# EAGLE schematic SRA_20_V8.7 (EAGLE 9.5.2)
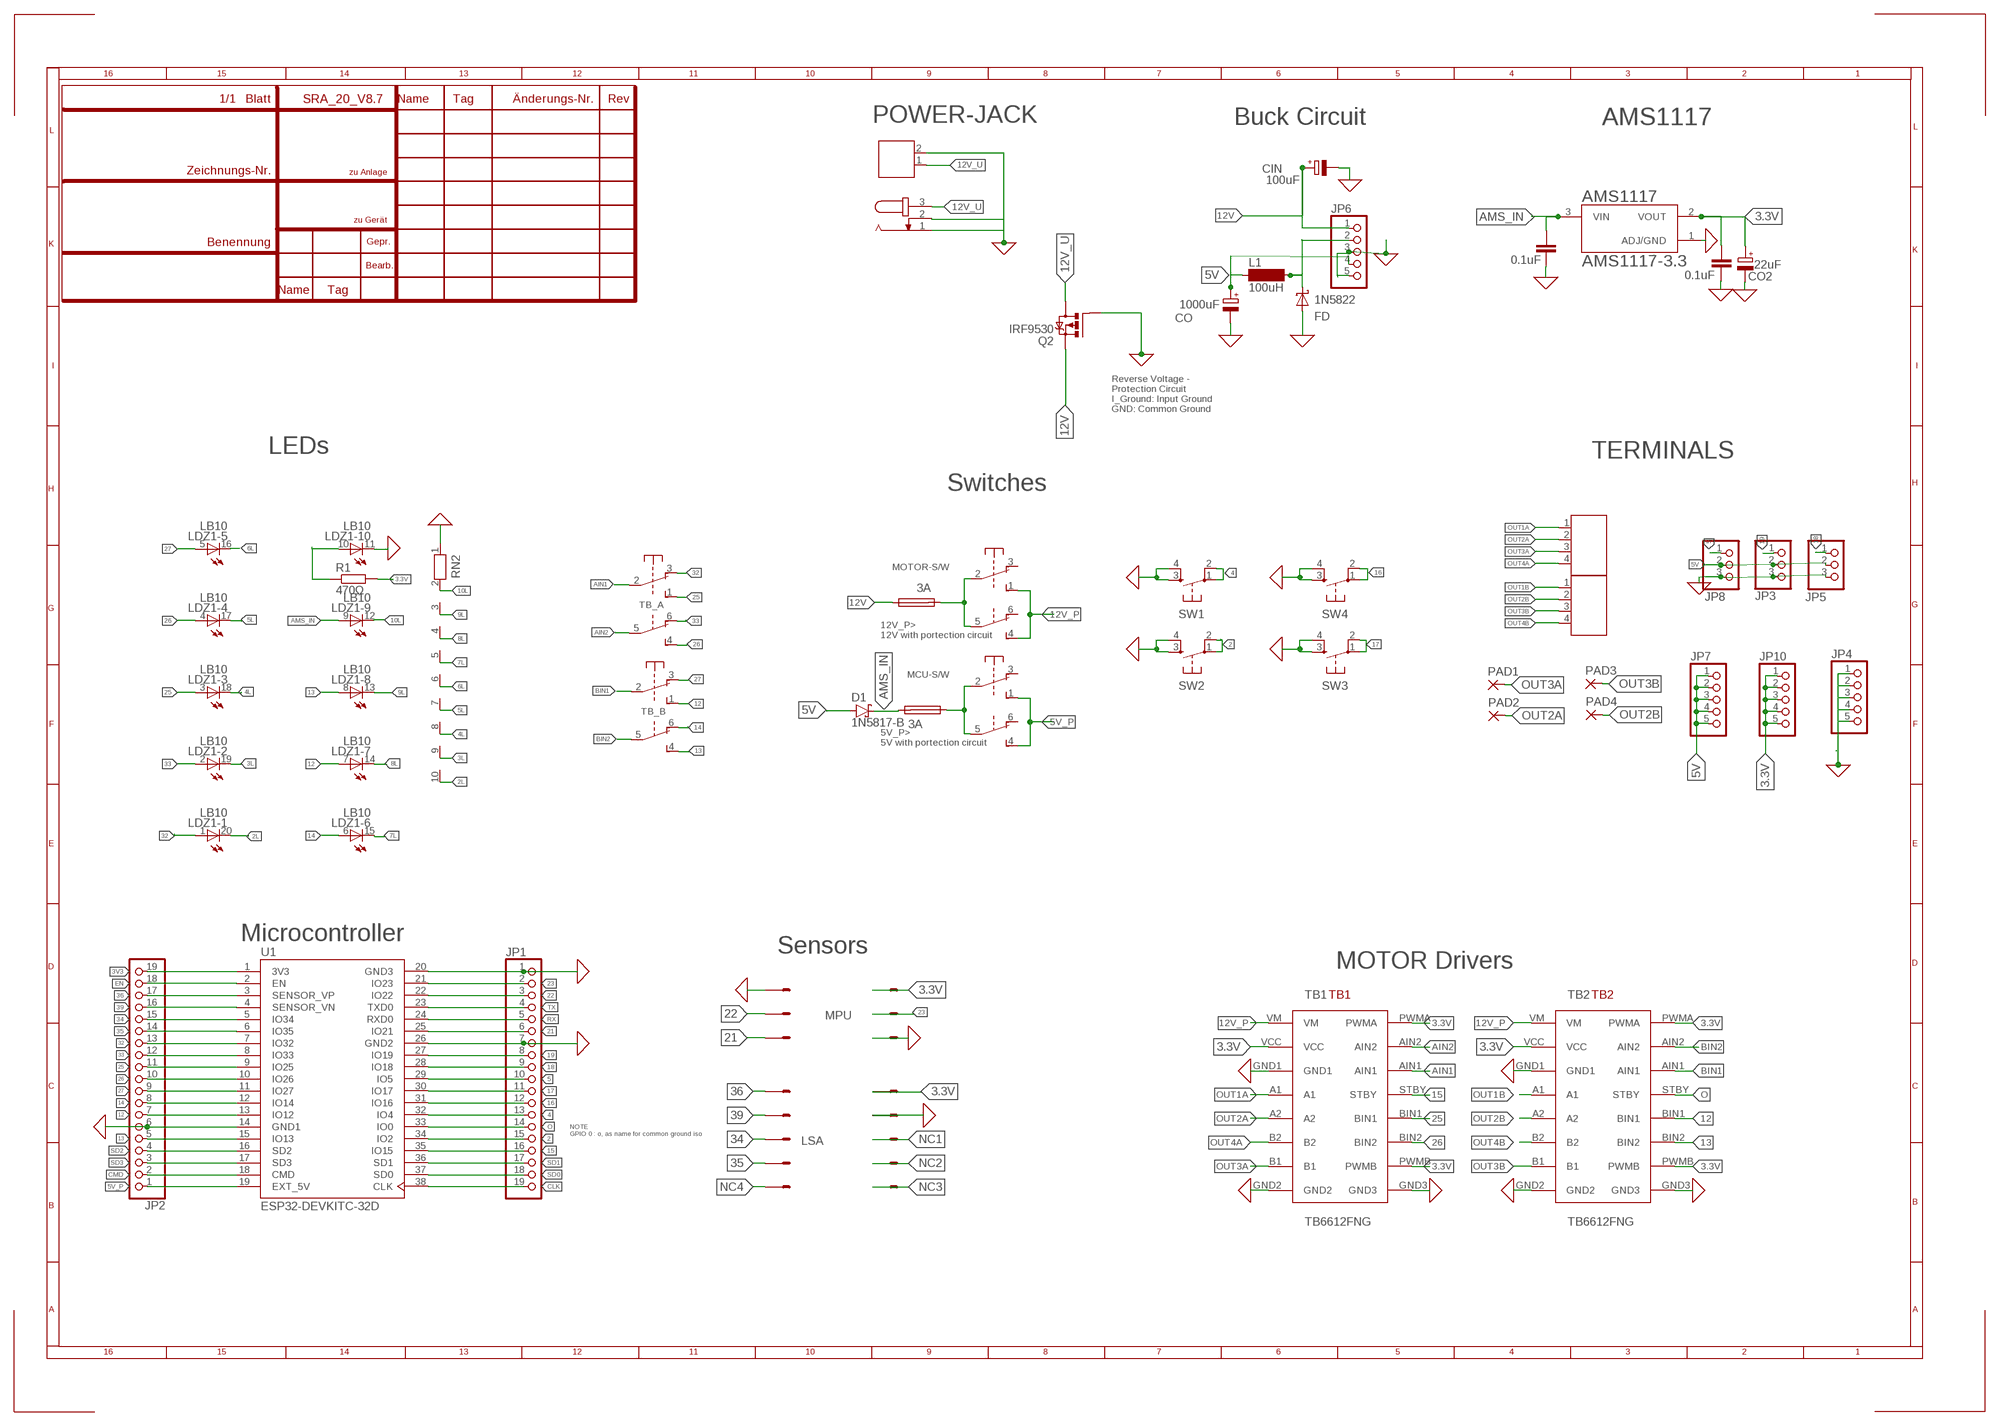
[diagram p0: schematic, sheet 1]

## Parts
12V  691131710002  [691131710002]
AMS1117  AMS1117-3.3  [SOT229P700X180-4N]
CIN  100uF  CPOL-EUE2.5-6  [E2,5-6]
CIN1  0.1uF  C5/2.5  [C5B2.5]
CO  1000uF  CPOL-EUE3.5-10  [E3,5-10]
CO1  0.1uF  C5/2.5  [C5B2.5]
CO2  22uF  CPOL-EUE2.5-6  [E2,5-6]
D1  1N5817-B  [DO41-7.6]
F2  3A  SH25  [SH25]
F3  3A  SH25  [SH25]
FD  1N5822  [DIOAD2120W130L950D530P]
J1  691131710004  [691131710004]
J2  691131710004  [691131710004]
JP1  PINHD-1X19  [1X19]
JP2  PINHD-1X19  [1X19]
JP3  PINHD-1X3  [1X03]
JP4  PINHD-1X5  [1X05]
JP5  PINHD-1X3  [1X03]
JP6  PINHD-1X5  [1X05]
JP7  PINHD-1X5  [1X05]
JP8  PINHD-1X3  [1X03]
JP10  PINHD-1X5  [1X05]
L1  100uH  SD12K100  [SD12K100]
LDZ1  LB10  [LB10]
LINE-SENSOR  057-010-1  [057-010-1]
MCU-S/W  9077-2  [9077-2]
MOTOR-S/W  9077-2  [9077-2]
PAD1  SMD2  [SMD1,27-2,54]
PAD2  SMD2  [SMD1,27-2,54]
PAD3  SMD2  [SMD1,27-2,54]
PAD4  SMD2  [SMD1,27-2,54]
POWER-JACK  JACK-PLUG1  [SPC4078]
Q2  IRF9530  [TO220BV]
R1  470Ω  R-EU_0204/7  [0204/7]
RN2  RN09  [RN-10]
SW1  DTS-6  [DTS-6]
SW2  DTS-6  [DTS-6]
SW3  DTS-6  [DTS-6]
SW4  DTS-6  [DTS-6]
TB1  TB6612FNG  [TB6612FNG]
TB2  TB6612FNG  [TB6612FNG]
TB_A  9077-2  [9077-2]
TB_B  9077-2  [9077-2]
U1  ESP32-DEVKITC-32D  [MODULE_ESP32-DEVKITC-32D]
X1  057-006-1  [057-006-1]

## Nets
0: 12V.2 AMS1117.1(ADJ/GND) CIN1.1 CIN.- CO1.1 CO2.- CO.- FD.A JP1.1 JP1.7 JP2.6 JP3.3 JP4.1 JP4.2 JP4.3 JP4.4 JP4.5 JP5.3 JP6.3 JP6.5 JP8.3 LDZ1.11(-10:C) LINE-SENSOR.4 POWER-JACK.1 POWER-JACK.2 Q2.G RN2.1 SW1.3 SW1.4 SW2.3 SW2.4 SW3.3 SW3.4 SW4.3 SW4.4 TB1.GND1 TB1.GND2 TB1.GND3 TB2.GND1 TB2.GND2 TB2.GND3 U1.14(GND1) U1.20(GND3) U1.26(GND2) X1.1 X1.6 ; supply symbol labelled GND
2: JP1.15 SW2.1 SW2.2 U1.34(IO2)
2L: LDZ1.20(-1:C) RN2.10
3.3V: AMS1117.2(VOUT) CO1.2 CO2.+ JP10.1 JP10.2 JP10.3 JP10.4 JP10.5 LINE-SENSOR.2 R1.2 TB1.PWMA TB1.PWMB TB1.VCC TB2.PWMA TB2.PWMB TB2.VCC X1.2
3L: LDZ1.19(-2:C) RN2.9
3V3: JP2.19 U1.1(3V3)
4: JP1.13 SW1.1 SW1.2 U1.32(IO4)
4L: LDZ1.18(-3:C) RN2.8
5: JP1.10 JP8.1 U1.29(IO5)
5_AF: F2.1 MCU-S/W.2(1:P) MCU-S/W.5(2:P)
5L: LDZ1.17(-4:C) RN2.7
5V: CO.+ D1.A JP3.2 JP5.2 JP6.4 JP7.1 JP7.2 JP7.3 JP7.4 JP7.5 JP8.2 L1.1
5V_P: JP2.1 MCU-S/W.1(1:S) MCU-S/W.4(2:S) U1.19(EXT_5V)
6L: LDZ1.16(-5:C) RN2.6
7L: LDZ1.15(-6:C) RN2.5
8L: LDZ1.14(-7:C) RN2.4
9L: LDZ1.13(-8:C) RN2.3
10L: LDZ1.12(-9:C) RN2.2
12: JP2.7 LDZ1.7(-7:A) TB2.BIN1 TB_B.1(1:S) U1.13(IO12)
12V: CIN.+ F3.1 JP6.1 Q2.S
12V_AF: F3.2 MOTOR-S/W.2(1:P) MOTOR-S/W.5(2:P)
12V_P: MOTOR-S/W.1(1:S) MOTOR-S/W.4(2:S) TB1.VM TB2.VM
12V_U: 12V.1 POWER-JACK.3 Q2.D
13: JP2.5 LDZ1.8(-8:A) TB2.BIN2 TB_B.4(2:S) U1.15(IO13)
14: JP2.8 LDZ1.6(-6:A) TB_B.6(2:O) U1.12(IO14)
15: JP1.16 TB1.STBY U1.35(IO15)
16: JP1.12 SW4.1 SW4.2 U1.31(IO16)
17: JP1.11 SW3.1 SW3.2 U1.30(IO17)
18: JP1.9 JP5.1 U1.28(IO18)
19: JP1.8 JP3.1 U1.27(IO19)
21: JP1.6 U1.25(IO21) X1.5
22: JP1.3 U1.22(IO22) X1.3
23: JP1.2 U1.21(IO23) X1.4
25: JP2.11 LDZ1.3(-3:A) TB1.BIN1 TB_A.1(1:S) U1.9(IO25)
26: JP2.10 LDZ1.4(-4:A) TB1.BIN2 TB_A.4(2:S) U1.10(IO26)
27: JP2.9 LDZ1.5(-5:A) TB_B.3(1:O) U1.11(IO27)
32: JP2.13 LDZ1.1(-1:A) TB_A.3(1:O) U1.7(IO32)
33: JP2.12 LDZ1.2(-2:A) TB_A.6(2:O) U1.8(IO33)
34: JP2.15 LINE-SENSOR.5 U1.5(IO34)
35: JP2.14 LINE-SENSOR.7 U1.6(IO35)
36: JP2.17 LINE-SENSOR.1 U1.3(SENSOR_VP)
39: JP2.16 LINE-SENSOR.3 U1.4(SENSOR_VN)
AIN1: TB1.AIN1 TB_A.2(1:P)
AIN2: TB1.AIN2 TB_A.5(2:P)
AMS_IN: AMS1117.3(VIN) CIN1.2 D1.C F2.2 LDZ1.9(-9:A)
BIN1: TB2.AIN1 TB_B.2(1:P)
BIN2: TB2.AIN2 TB_B.5(2:P)
CLK: JP1.19 U1.38(CLK)
CMD: JP2.2 U1.18(CMD)
EN: JP2.18 U1.2(EN)
N$1: LDZ1.10(-10:A) R1.1
N$11: FD.C JP6.2 L1.2
NC1: LINE-SENSOR.6
NC2: LINE-SENSOR.8
NC3: LINE-SENSOR.10
NC4: LINE-SENSOR.9
O: JP1.14 TB2.STBY U1.33(IO0)
OUT1A: J1.1 TB1.A1
OUT1B: J2.1 TB2.A1
OUT2A: J1.2 PAD2.1(P) TB1.A2
OUT2B: J2.2 PAD4.1(P) TB2.A2
OUT3A: J1.3 PAD1.1(P) TB1.B1
OUT3B: J2.3 PAD3.1(P) TB2.B1
OUT4A: J1.4 TB1.B2
OUT4B: J2.4 TB2.B2
RX: JP1.5 U1.24(RXD0)
SD0: JP1.18 U1.37(SD0)
SD1: JP1.17 U1.36(SD1)
SD2: JP2.4 U1.16(SD2)
SD3: JP2.3 U1.17(SD3)
TX: JP1.4 U1.23(TXD0)
Unconnected: MCU-S/W.3(1:O) MCU-S/W.6(2:O) MOTOR-S/W.3(1:O) MOTOR-S/W.6(2:O)

## Notes on the sheet
- Buck Circuit | AMS1117
- Reverse Voltage -
  Protection Circuit
  I_Ground: Input Ground
  GND: Common Ground
- TERMINALS
- LEDs
- Switches
- 12V_P>
  12V with portection circuit
- 5V_P> 
  5V with portection circuit
- Microcontroller
- Sensors | MOTOR Drivers
- MPU
- NOTE
  GPIO 0 : o, as name for common ground iso
- LSA

## Library data of the parts
12V = Wurth_Elektronik_Electromechanic_Terminal_Blocks_Connectors_rev16b:691131710002: WR-TBL Terminal block - CUU5/2 CUU5/2GR - 2 Pins;=>Code : Con_TBL_Screw_PClamp_5.00_6911317100xx_691131710002 <http://katalog.we-online.de/media/images/eican/Con_TBL_Screw_PClamp_5.00_6911317100xx_pf2.jpg> Details see: http://katalog.we-online.de/em/datasheet/6911317100xx.pdf Created 11/23/2014, Karrer Zheng 2014 (C) Wurth Elektronik
AMS1117 = AMS1117-3.3:AMS1117-3.3: Sot223/Pkg 1-Amp 3.3-Volt Low Drop Out Voltage Regulatator; AVAILABILITY: Unavailable; DESCRIPTION: Sot223/Pkg 1-Amp 3.3-Volt Low Drop Out Voltage Regulatator; MF: Advanced Monolithic Systems; MP: AMS1117-3.3; PACKAGE: None; PRICE: None
CIN CO CO2 = rcl:CPOL-EU: POLARIZED CAPACITOR, European symbol; SPICEPREFIX: C
CIN1 CO1 = capacitor-wima:C: CAPACITOR naming: grid - package width
D1 = diode:1N581*: 1.0A SCHOTTKY BARRIER RECTIFIER Source: http://www.diodes.com/datasheets/ds23001.pdf
F2 F3 = fuse:SH25: FUSE HOLDER grid 25 mm, OGN0031 8211, Schurter (Buerklin); MF: SCHURTER; MPN: 0031.8211; OC_FARNELL: 1162741; OC_NEWARK: 96B9380
FD = 1N5822:1N5822: 1N5822 Series 40 V 3 A Through Hole Schottky Rectifier - DO-201AD; AVAILABILITY: Unavailable; MF: ON Semiconductor; MP: 1N5822; PACKAGE: DO-201AD-201 CDIL; PRICE: None
J1 J2 = Wurth_Elektronik_Electromechanic_Terminal_Blocks_Connectors_rev16b:691131710004: WR-TBL Terminal block - CUU5/4 - 4 Pins;=>Code : Con_TBL_Screw_PClamp_5.00_6911317100xx_691131710004 <http://katalog.we-online.de/media/images/eican/Con_TBL_Screw_PClamp_5.00_6911317100xx_pf2.jpg> Details see: http://katalog.we-online.de/em/datasheet/6911317100xx.pdf Created 11/3/2014, Karrer Zheng 2014 (C) Wurth Elektronik
JP1 JP2 = pinhead:PINHD-1X19: PIN HEADER
JP3 JP5 JP8 = pinhead_2:PINHD-1X3: PIN HEADER
JP4 JP7 JP10 = pinhead_2:PINHD-1X5: PIN HEADER
JP6 = pinhead:PINHD-1X5: PIN HEADER
L1 = inductor-neosid:SD12: INDUCTOR nominal inductance; OC_FARNELL: unknown; OC_NEWARK: unknown
LDZ1 = led:LB10: LED BLOCK 10-LED bar graph, DIL, Siemens
LINE-SENSOR = con-panduit:057-010-: CONNECTOR 10-pin series 057 contact pc board low profile headers; OC_FARNELL: unknown; OC_NEWARK: unknown
MCU-S/W MOTOR-S/W TB_A TB_B = switch-misc:9077-2: MARQUARDT SWITCH 9077.0200 Distributor: Buerklin <https://www.buerklin.com/default.asp?event=ShowArtikel%2812G2822%29&l=d&jump=ArtNr_12G2822>
PAD1-PAD4 = wirepad_2:SMD2: SMD PAD
POWER-JACK = con-jack:JACK-PLUG: DC POWER JACK Power Jack, DC, Right Angle, Through Hole, Rated 5A at 16VDC, PC Terminals Distributor: Farnell (www.Farnell.de) Drawing: 84N1161.pdf / 84N1162.pdf Manufacturer: SPC Technology (www.spctechnology.com) Type: SPC4077 / SPC 4078; OC_FARNELL: unknown; OC_NEWARK: unknown
Q2 = transistor-power:IRF9530: P-CHANNEL HEXFET POWER-MOS-FET Source: http://www.irf.com/product-info/datasheets/data/irf9530.pdf
R1 = rcl:R-EU_: RESISTOR, European symbol; SPICEPREFIX: R
RN2 = resistor-net:RN09: RESISTOR NETWORK; OC_FARNELL: unknown; OC_NEWARK: unknown
SW1-SW4 = switch-tact:DTS-6
TB1 TB2 = TB6612FNG:TB6612FNG
U1 = ESP32-DEVKITC-32D:ESP32-DEVKITC-32D: Eval Board For Esp-Wroom-32; AVAILABILITY: Unavailable; DESCRIPTION: - Transceiver; 802.11 b/g/n _Wi-Fi, WiFi, WLAN_, Bluetooth® Smart Ready 4.x Dual Mode For Use With ESP-WROOM-32; MF: Espressif Systems; MP: ESP32-DEVKITC-32D; PACKAGE: None; PRICE: None
X1 = con-panduit:057-006-: CONNECTOR 6-pin series 057 contact pc board low profile headers; OC_FARNELL: unknown; OC_NEWARK: unknown